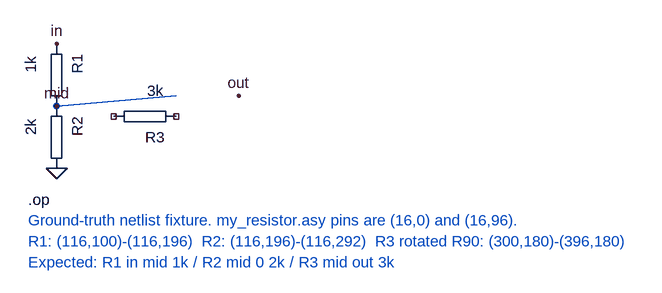
[diagram p0: schematic connected_ladder.asc]
connected_ladder.asc, the LTspice schematic file:
Version 4
SHEET 1 880 680
WIRE 300 180 116 196
FLAG 116 100 in
FLAG 116 196 mid
FLAG 116 292 0
FLAG 396 180 out
SYMBOL my_resistor 100 100 R0
SYMATTR InstName R1
SYMATTR Value 1k
SYMBOL my_resistor 100 196 R0
SYMATTR InstName R2
SYMATTR Value 2k
SYMBOL my_resistor 300 196 R90
SYMATTR InstName R3
SYMATTR Value 3k
TEXT 72 340 Left 2 !.op
TEXT 72 372 Left 2 ;Ground-truth netlist fixture. my_resistor.asy pins are (16,0) and (16,96).
TEXT 72 404 Left 2 ;R1: (116,100)-(116,196)  R2: (116,196)-(116,292)  R3 rotated R90: (300,180)-(396,180)
TEXT 72 436 Left 2 ;Expected: R1 in mid 1k / R2 mid 0 2k / R3 mid out 3k

The netlist it stands for:
* connected_ladder.asc
R1 in mid 1k
R2 mid 0 2k
R3 NC_01 NC_02 3k
.op
* Ground-truth netlist fixture. my_resistor.asy pins are (16,0) and (16,96).
* R1: (116,100)-(116,196)  R2: (116,196)-(116,292)  R3 rotated R90: (300,180)-(396,180)
* Expected: R1 in mid 1k / R2 mid 0 2k / R3 mid out 3k
.backanno
.end